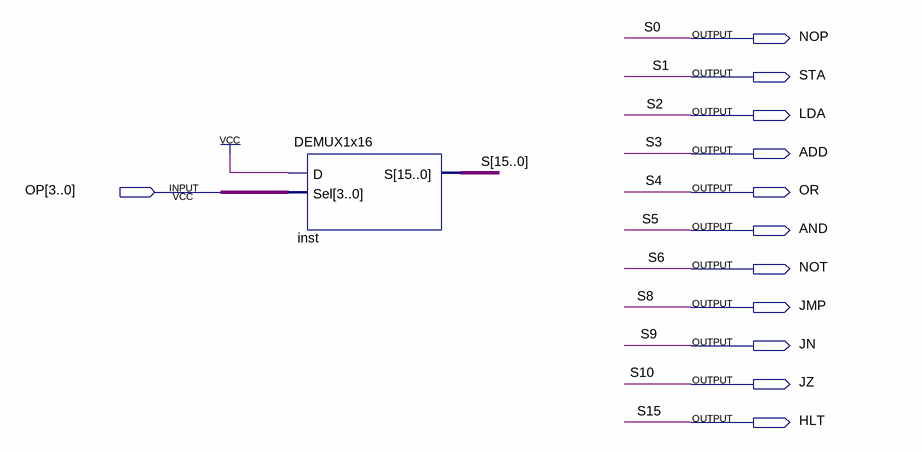
[diagram p0: schematic sheet]
// Quartus schematic OPCODE_decoder.bdf as structural Verilog: 1 symbols, 12 pins
module OPCODE_decoder (
  input  [3:0] OP,
  output NOP,
  output STA,
  output LDA,
  output ADD,
  output OR,
  output AND,
  output NOT,
  output JMP,
  output JN,
  output JZ,
  output HLT
);

  wire [14:7] S;

  DEMUX1x16 inst (.D(1'b1), .Sel(OP), .S({HLT, S[14:11], JZ, JN, JMP, S[7], NOT, AND, OR, ADD, LDA, STA, NOP}));

  // Other names for the same wires on the sheet: S (some bits) = {HLT, JZ, JN, JMP, NOT, AND, OR, ADD, LDA, STA, NOP};
  //   S0 = NOP; S1 = STA; S2 = LDA; S3 = ADD; S4 = OR; S5 = AND; S6 = NOT; S8 = JMP; S9 = JN; S10 = JZ; S15 = HLT
endmodule
